# EasyEDA schematic 566b4b7e-ffb1-47f2-8e62-ae72dd2330f2.json
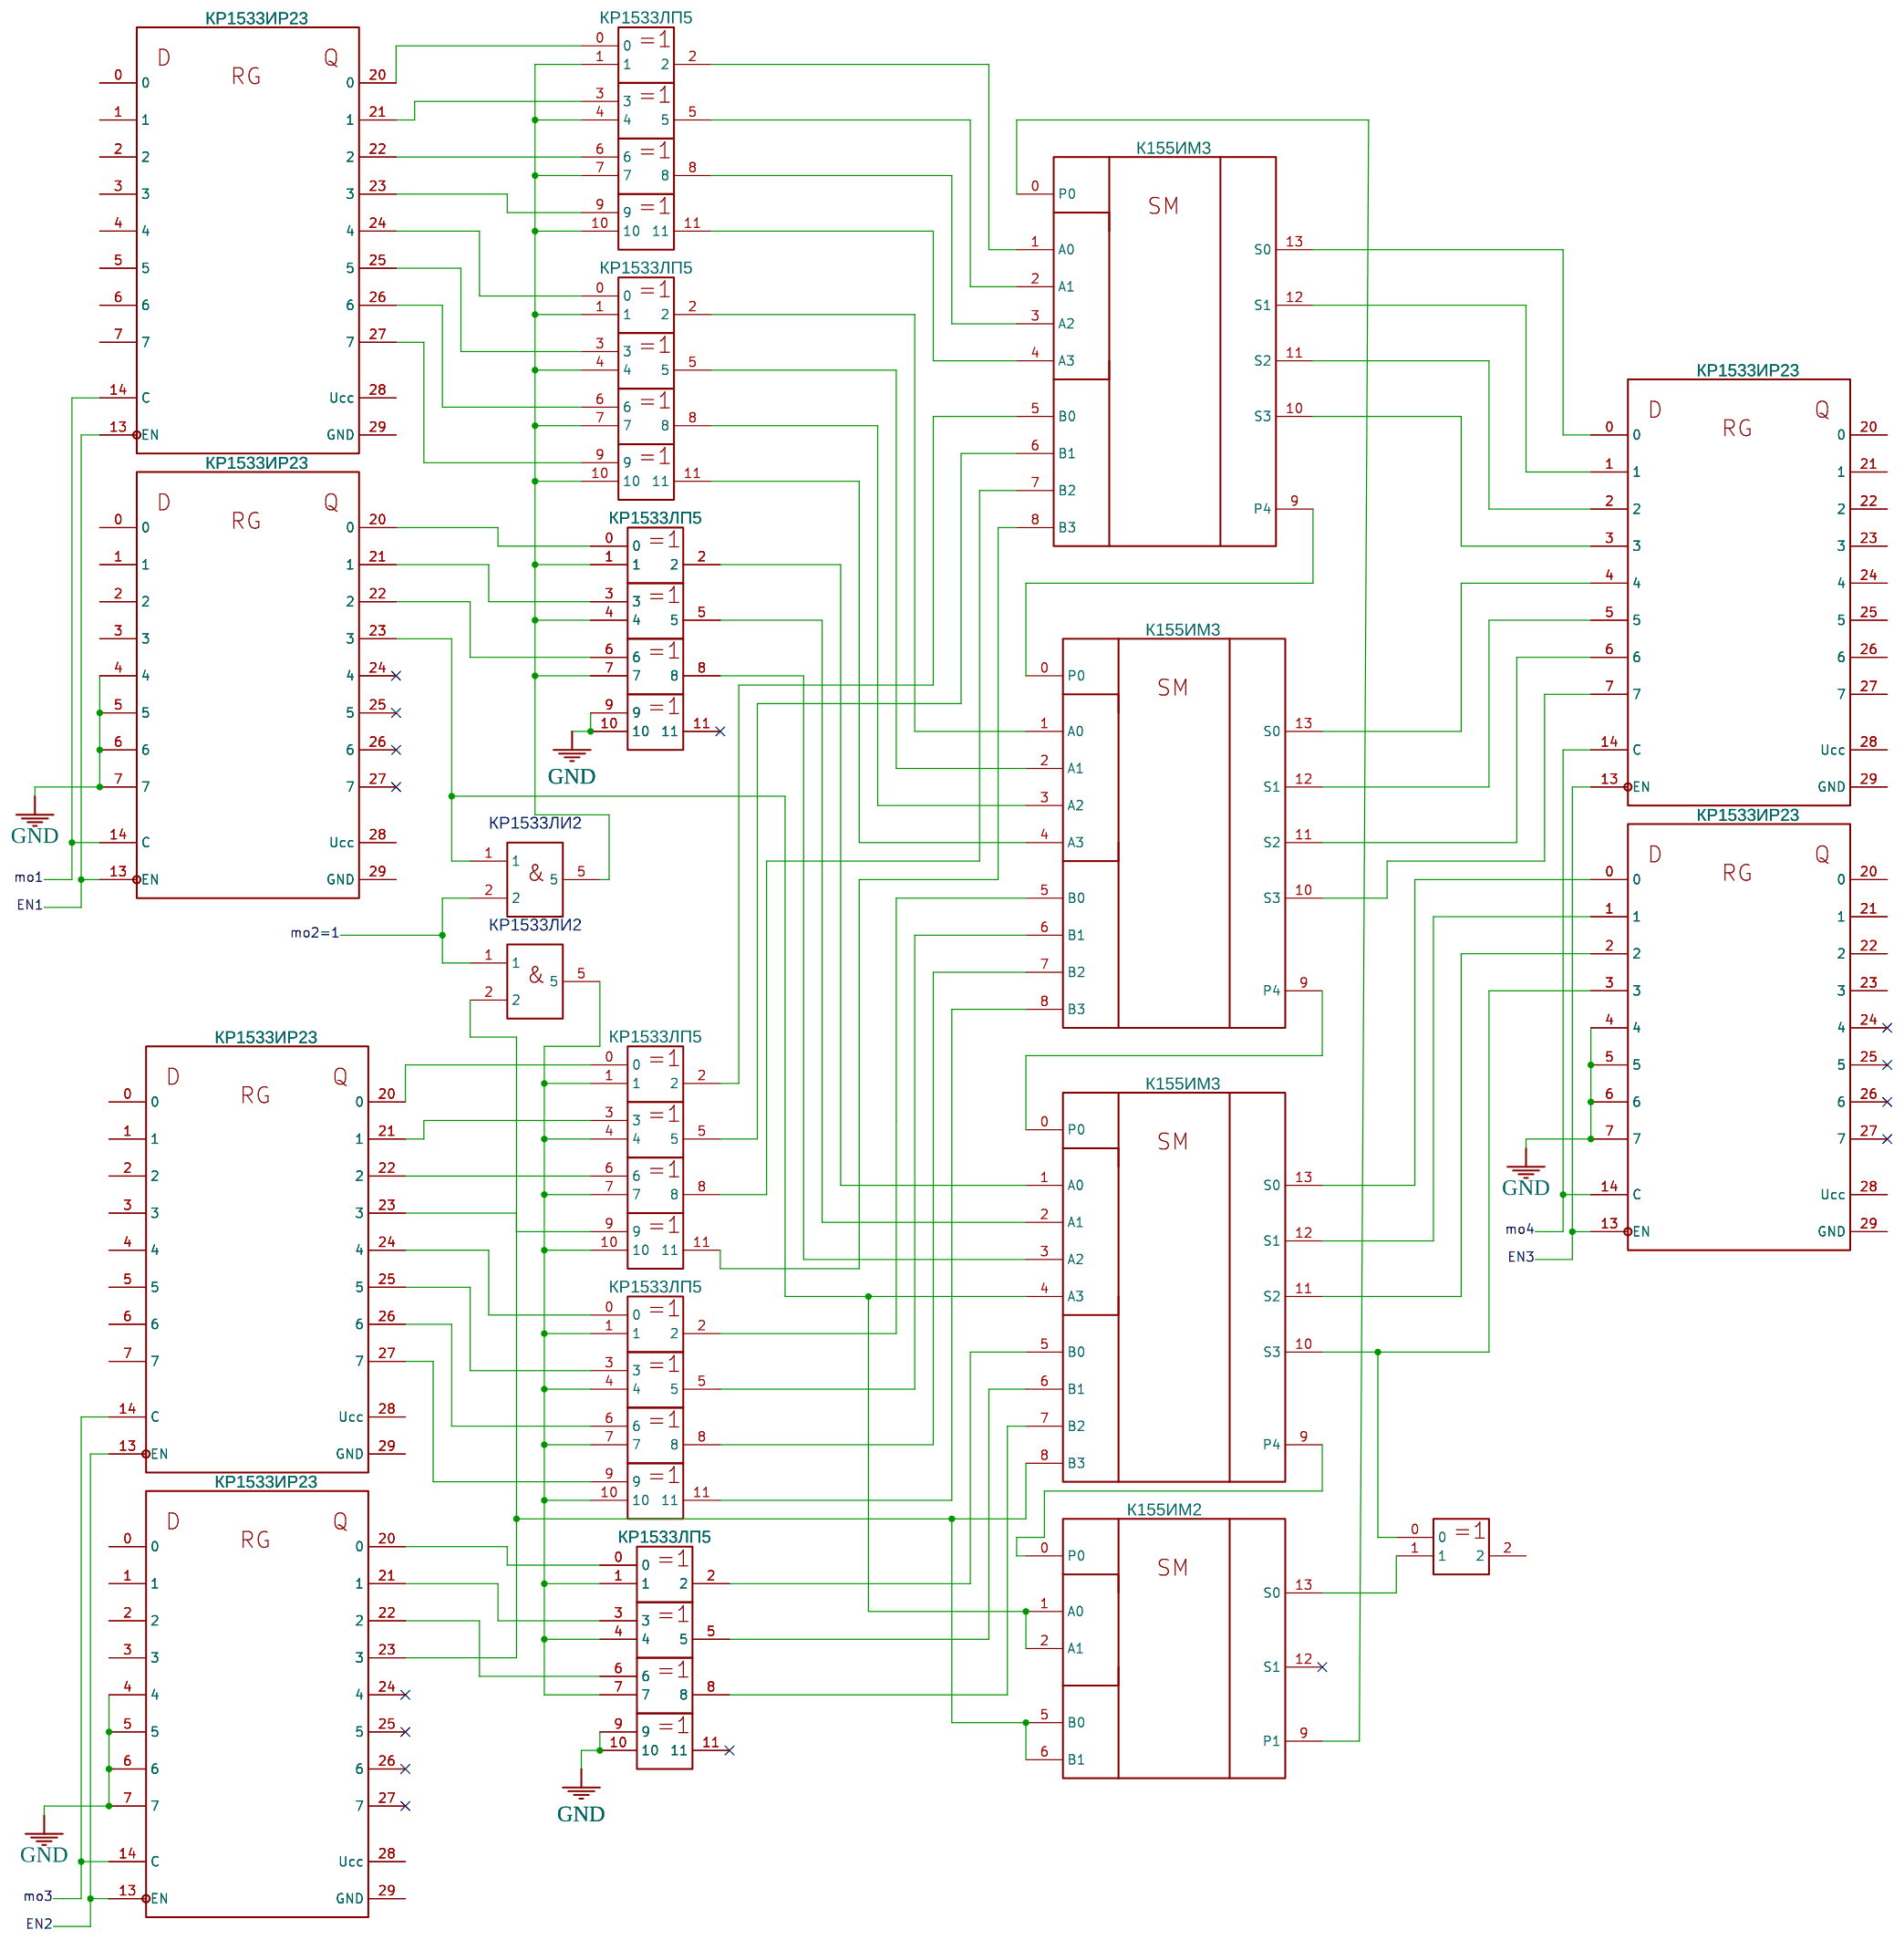
[diagram p0: schematic sheet]

## Parts
U1  КР1533ИР23
U2  К155ИМ3
U3  and_or
U4  КР1533ЛП5
U5  КР1533ЛП5
U6  КР1533ЛП5
U7  КР1533ИР23
U8  К155ИМ3
U9  КР1533ИР23
U10  КР1533ИР23
U11  КР1533ЛП5
U12  КР1533ЛП5
U13  КР1533ЛП5
U14  and_or
U15  К155ИМ3
U16  КР1533ИР23
U17  КР1533ИР23
U18  К155ИМ2
U19  4_xor

## Library data of the parts
U1 U7 U9 U10 U16 U17 = regist_8: catid: 20; Contributor: nibiru.crs; sim: true
U2 U8 U15 = SM: catid: 20; Contributor: nibiru.crs; sim: true
U3 U14 = and_or: catid: 20; Contributor: nibiru.crs; sim: true
U4-U6 U11-U13 U19 = 4_xor: catid: 20; Contributor: nibiru.crs; sim: true
U18 = SM_2: catid: 20; Contributor: nibiru.crs; sim: true

## Nets
GND: U1.4 U1.5 U1.6 U1.7 U6.9 U6.10 U9.4 U9.5 U9.6 U9.7 U11.9 U11.10 U16.4 U16.5 U16.6 U16.7
EN1: U1.13(EN) U7.13(EN)
EN2: U9.13(EN) U10.13(EN)
EN3: U16.13(EN) U17.13(EN)
mo1: U1.14(C) U7.14(C)
mo2=1: U3.2 U14.1
mo3: U9.14(C) U10.14(C)
mo4: U16.14(C) U17.14(C)
Net-(U1-20): U1.20(0) U6.0
Net-(U1-21): U1.21(1) U6.3
Net-(U1-22): U1.22(2) U6.6
Net-(U1-23): U1.23(3) U3.1 U15.4(A3) U18.1(A0) U18.2(A1)
Net-(U2-0): U2.0(P0) U18.9(P1)
Net-(U2-1): U2.1(A0) U4.2
Net-(U2-2): U2.2(A1) U4.5
Net-(U2-3): U2.3(A2) U4.8
Net-(U2-4): U2.4(A3) U4.11
Net-(U2-5): U2.5(B0) U13.2
Net-(U2-6): U2.6(B1) U13.5
Net-(U2-7): U2.7(B2) U13.8
Net-(U2-8): U2.8(B3) U13.11
Net-(U2-9): U2.9(P4) U8.0(P0)
Net-(U2-10): U2.10(S3) U17.3
Net-(U2-11): U2.11(S2) U17.2
Net-(U2-12): U2.12(S1) U17.1
Net-(U2-13): U2.13(S0) U17.0
Net-(U3-5): U3.5 U4.1 U4.4 U4.7 U4.10 U5.1 U5.4 U5.7 U5.10 U6.1 U6.4 U6.7
Net-(U4-0): U4.0 U7.20(0)
Net-(U4-3): U4.3 U7.21(1)
Net-(U4-6): U4.6 U7.22(2)
Net-(U4-9): U4.9 U7.23(3)
Net-(U5-0): U5.0 U7.24(4)
Net-(U5-2): U5.2 U8.1(A0)
Net-(U5-3): U5.3 U7.25(5)
Net-(U5-5): U5.5 U8.2(A1)
Net-(U5-6): U5.6 U7.26(6)
Net-(U5-8): U5.8 U8.3(A2)
Net-(U5-9): U5.9 U7.27(7)
Net-(U5-11): U5.11 U8.4(A3)
Net-(U6-2): U6.2 U15.1(A0)
Net-(U6-5): U6.5 U15.2(A1)
Net-(U6-8): U6.8 U15.3(A2)
Net-(U8-5): U8.5(B0) U12.2
Net-(U8-6): U8.6(B1) U12.5
Net-(U8-7): U8.7(B2) U12.8
Net-(U8-8): U8.8(B3) U12.11
Net-(U8-9): U8.9(P4) U15.0(P0)
Net-(U8-10): U8.10(S3) U17.7
Net-(U8-11): U8.11(S2) U17.6
Net-(U8-12): U8.12(S1) U17.5
Net-(U8-13): U8.13(S0) U17.4
Net-(U9-20): U9.20(0) U11.0
Net-(U9-21): U9.21(1) U11.3
Net-(U9-22): U9.22(2) U11.6
Net-(U9-23): U9.23(3) U14.2 U15.8(B3) U18.5(B0) U18.6(B1)
Net-(U10-20): U10.20(0) U13.0
Net-(U10-21): U10.21(1) U13.3
Net-(U10-22): U10.22(2) U13.6
Net-(U10-23): U10.23(3) U13.9
Net-(U10-24): U10.24(4) U12.0
Net-(U10-25): U10.25(5) U12.3
Net-(U10-26): U10.26(6) U12.6
Net-(U10-27): U10.27(7) U12.9
Net-(U11-1): U11.1 U11.4 U11.7 U12.1 U12.4 U12.7 U12.10 U13.1 U13.4 U13.7 U13.10 U14.5
Net-(U11-2): U11.2 U15.5(B0)
Net-(U11-5): U11.5 U15.6(B1)
Net-(U11-8): U11.8 U15.7(B2)
Net-(U15-9): U15.9(P4) U18.0(P0)
Net-(U15-10): U15.10(S3) U16.3 U19.0
Net-(U15-11): U15.11(S2) U16.2
Net-(U15-12): U15.12(S1) U16.1
Net-(U15-13): U15.13(S0) U16.0
Net-(U18-13): U18.13(S0) U19.1

Not connected (* = marked no-connect by the designer): U1 0 1 2 3 24(4)* 25(5)* 26(6)* 27(7)* 28(Ucc) 29(GND); U6 11*; U7 0 1 2 3 4 5 6 7 28(Ucc) 29(GND); U9 0 1 2 3 24(4)* 25(5)* 26(6)* 27(7)* 28(Ucc) 29(GND); U10 0 1 2 3 4 5 6 7 28(Ucc) 29(GND); U11 11*; U16 20(0) 21(1) 22(2) 23(3) 24(4)* 25(5)* 26(6)* 27(7)* 28(Ucc) 29(GND); U17 20(0) 21(1) 22(2) 23(3) 24(4) 25(5) 26(6) 27(7) 28(Ucc) 29(GND); U18 12(S1)*; U19 2

## Notes on the sheet
- КР1533ЛИ2
- КР1533ЛИ2
